# Altium project SRLatch_EJ6.PrjPcb
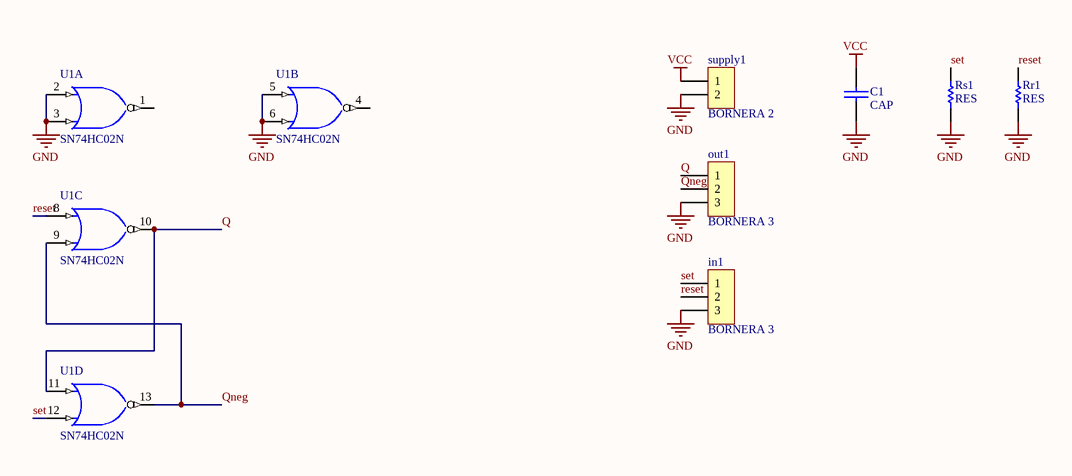
[diagram p0: SRLatch.SchDoc]
1 sheet, 7 parts. Net scope: global (net labels, ports and power ports of the same name join across sheets).
Board file: SRLatch.PcbDoc

## Sheet SRLatch.SchDoc
size A4

### Parts
C1  CAP  [CAP100]
in1  BORNERA 3  [BORNERA3]
out1  BORNERA 3  [BORNERA3]
Rr1  RES  [0805]
Rs1  RES  [0805]
supply1  BORNERA 2  [BORNERA2]
U1  SN74HC02N  [N014]  (parts A,B,C,D of 4)

### Nets
GND: C1.2 in1.3 out1.3 Rr1.1 Rs1.1 supply1.2 U1.2(A) U1.3(B) U1.5(A) U1.6(B) U1.7(GND)
VCC: C1.1 supply1.1 U1.14(VCC)
Q: out1.1 U1.10(Y) U1.11(A)
Qneg: out1.2 U1.9(B) U1.13(Y)
reset: in1.2 Rr1.2 U1.8(A)
set: in1.1 Rs1.2 U1.12(B)

Not connected (* = marked no-connect by the designer): U1 1(Y) 4(Y)

### Library data of the parts
U1 = SN74HC02N: Quadruple 2-Input Positive-NOR Gate; Published: 8-Jun-2000; LatestRevisionDate: 04-Mar-2005; LatestRevisionNote: Stylized 3D Model Added.; DatasheetVersion: May-1997; PackageVersion: Oct-1995; PackageReference: N014; Publisher: Altium Limited; PackageDescription: DIP; 14 Leads; Row Spacing 7.62 mm; Pitch 2.54 mm; ComponentLink1Description: Manufacturer Link; ComponentLink1URL: http://www.ti.com/; ComponentLink2Description: Datasheet; ComponentLink2URL: http://www-s.ti.com/sc/ds/sn74hc02.pdf